# EAGLE design PowerMeterCurrent (EAGLE 9.3.0)
DATABASE: ../../../../digikeydb.txt
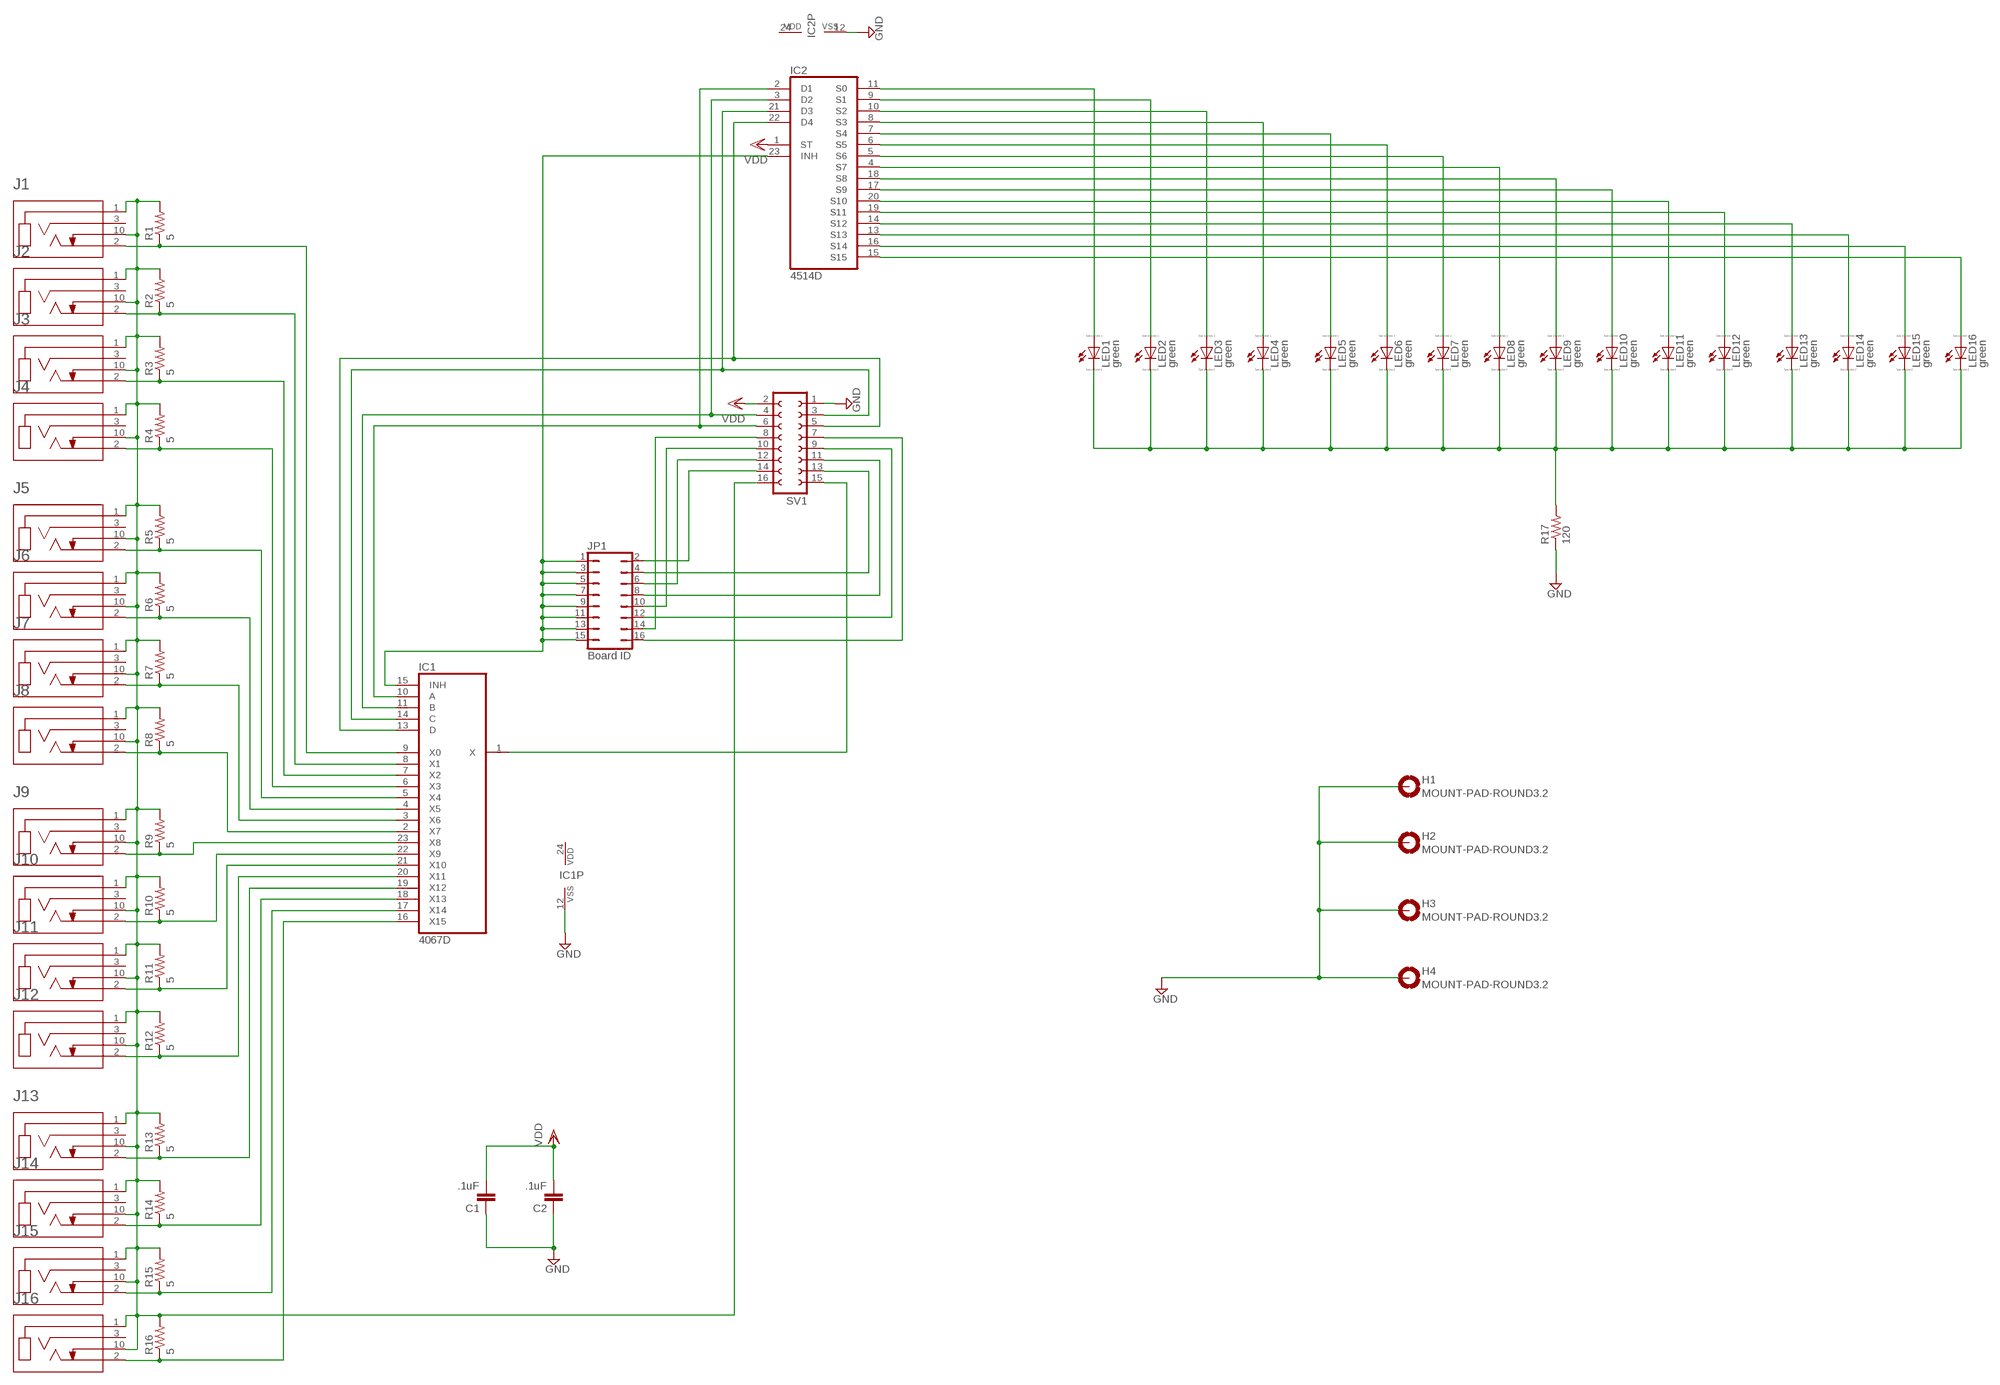
[diagram p0: schematic, sheet 1]

## Parts
C1  .1uF  C-EUC1206  [C1206]
C2  .1uF  C-EUC1206  [C1206]
H1  MOUNT-PAD-ROUND3.2  [3,2-PAD]
H2  MOUNT-PAD-ROUND3.2  [3,2-PAD]
H3  MOUNT-PAD-ROUND3.2  [3,2-PAD]
H4  MOUNT-PAD-ROUND3.2  [3,2-PAD]
IC1  4067D  [SO24W]
IC2  4514D  [SO24W]
J1  SJ2-35813B-SMT-TR  [CUI_SJ2-35813B-SMT-TR]
J2  SJ2-35813B-SMT-TR  [CUI_SJ2-35813B-SMT-TR]
J3  SJ2-35813B-SMT-TR  [CUI_SJ2-35813B-SMT-TR]
J4  SJ2-35813B-SMT-TR  [CUI_SJ2-35813B-SMT-TR]
J5  SJ2-35813B-SMT-TR  [CUI_SJ2-35813B-SMT-TR]
J6  SJ2-35813B-SMT-TR  [CUI_SJ2-35813B-SMT-TR]
J7  SJ2-35813B-SMT-TR  [CUI_SJ2-35813B-SMT-TR]
J8  SJ2-35813B-SMT-TR  [CUI_SJ2-35813B-SMT-TR]
J9  SJ2-35813B-SMT-TR  [CUI_SJ2-35813B-SMT-TR]
J10  SJ2-35813B-SMT-TR  [CUI_SJ2-35813B-SMT-TR]
J11  SJ2-35813B-SMT-TR  [CUI_SJ2-35813B-SMT-TR]
J12  SJ2-35813B-SMT-TR  [CUI_SJ2-35813B-SMT-TR]
J13  SJ2-35813B-SMT-TR  [CUI_SJ2-35813B-SMT-TR]
J14  SJ2-35813B-SMT-TR  [CUI_SJ2-35813B-SMT-TR]
J15  SJ2-35813B-SMT-TR  [CUI_SJ2-35813B-SMT-TR]
J16  SJ2-35813B-SMT-TR  [CUI_SJ2-35813B-SMT-TR]
JP1  Board ID  JP8Q  [JP8Q]
LED1  green  LED_E  [LED_1206]
LED2  green  LED_E  [LED_1206]
LED3  green  LED_E  [LED_1206]
LED4  green  LED_E  [LED_1206]
LED5  green  LED_E  [LED_1206]
LED6  green  LED_E  [LED_1206]
LED7  green  LED_E  [LED_1206]
LED8  green  LED_E  [LED_1206]
LED9  green  LED_E  [LED_1206]
LED10  green  LED_E  [LED_1206]
LED11  green  LED_E  [LED_1206]
LED12  green  LED_E  [LED_1206]
LED13  green  LED_E  [LED_1206]
LED14  green  LED_E  [LED_1206]
LED15  green  LED_E  [LED_1206]
LED16  green  LED_E  [LED_1206]
R1  5  R-US_R1206  [R1206]
R2  5  R-US_R1206  [R1206]
R3  5  R-US_R1206  [R1206]
R4  5  R-US_R1206  [R1206]
R5  5  R-US_R1206  [R1206]
R6  5  R-US_R1206  [R1206]
R7  5  R-US_R1206  [R1206]
R8  5  R-US_R1206  [R1206]
R9  5  R-US_R1206  [R1206]
R10  5  R-US_R1206  [R1206]
R11  5  R-US_R1206  [R1206]
R12  5  R-US_R1206  [R1206]
R13  5  R-US_R1206  [R1206]
R14  5  R-US_R1206  [R1206]
R15  5  R-US_R1206  [R1206]
R16  5  R-US_R1206  [R1206]
R17  120  R-US_R1206  [R1206]
SV1  FE08-2  [FE08-2]

## Nets
CT-: J1.1(SLEEVE) J1.10(TIP_SWITCH) J2.1(SLEEVE) J2.10(TIP_SWITCH) J3.1(SLEEVE) J3.10(TIP_SWITCH) J4.1(SLEEVE) J4.10(TIP_SWITCH) J5.1(SLEEVE) J5.10(TIP_SWITCH) J6.1(SLEEVE) J6.10(TIP_SWITCH) J7.1(SLEEVE) J7.10(TIP_SWITCH) J8.1(SLEEVE) J8.10(TIP_SWITCH) J9.1(SLEEVE) J9.10(TIP_SWITCH) J10.1(SLEEVE) J10.10(TIP_SWITCH) J11.1(SLEEVE) J11.10(TIP_SWITCH) J12.1(SLEEVE) J12.10(TIP_SWITCH) J13.1(SLEEVE) J13.10(TIP_SWITCH) J14.1(SLEEVE) J14.10(TIP_SWITCH) J15.1(SLEEVE) J15.10(TIP_SWITCH) J16.1(SLEEVE) J16.10(TIP_SWITCH) R1.2 R2.2 R3.2 R4.2 R5.2 R6.2 R7.2 R8.2 R9.2 R10.2 R11.2 R12.2 R13.2 R14.2 R15.2 R16.2 SV1.16
GND: C1.1 C2.1 H1.B3,2(MOUNT) H2.B3,2(MOUNT) H3.B3,2(MOUNT) H4.B3,2(MOUNT) IC1.12(VSS) IC2.12(VSS) R17.1 SV1.1
N$1: IC1.10(A) IC2.2(D1) SV1.6
N$2: IC2.15(S15) LED16.A
N$3: IC1.11(B) IC2.3(D2) SV1.4
N$4: IC1.14(C) IC2.21(D3) SV1.3
N$5: IC1.13(D) IC2.22(D4) SV1.5
N$6: IC1.15(INH) IC2.23(INH) JP1.1 JP1.3 JP1.5 JP1.7 JP1.9 JP1.11 JP1.13 JP1.15
N$7: JP1.14 SV1.8
N$8: JP1.10 SV1.10
N$9: IC2.16(S14) LED15.A
N$10: JP1.6 SV1.12
N$11: JP1.2 SV1.14
N$13: JP1.4 SV1.13
N$14: JP1.8 SV1.11
N$15: JP1.12 SV1.9
N$16: JP1.16 SV1.7
N$17: IC1.1(X) SV1.15
N$18: IC1.5(X4) J5.2(TIP) R5.1
N$19: IC2.13(S13) LED14.A
N$20: IC1.9(X0) J1.2(TIP) R1.1
N$21: LED1.C LED2.C LED3.C LED4.C LED5.C LED6.C LED7.C LED8.C LED9.C LED10.C LED11.C LED12.C LED13.C LED14.C LED15.C LED16.C R17.2
N$22: IC1.8(X1) J2.2(TIP) R2.1
N$23: IC1.7(X2) J3.2(TIP) R3.1
N$24: IC1.6(X3) J4.2(TIP) R4.1
N$25: IC1.4(X5) J6.2(TIP) R6.1
N$26: IC1.3(X6) J7.2(TIP) R7.1
N$28: IC1.2(X7) J8.2(TIP) R8.1
N$29: IC1.23(X8) J9.2(TIP) R9.1
N$30: IC2.14(S12) LED13.A
N$32: IC2.19(S11) LED12.A
N$34: IC2.20(S10) LED11.A
N$36: IC2.17(S9) LED10.A
N$38: IC2.18(S8) LED9.A
N$40: IC2.4(S7) LED8.A
N$42: IC2.5(S6) LED7.A
N$44: IC2.6(S5) LED6.A
N$46: IC2.7(S4) LED5.A
N$48: IC2.8(S3) LED4.A
N$50: IC1.22(X9) J10.2(TIP) R10.1
N$51: IC1.21(X10) J11.2(TIP) R11.1
N$52: IC2.10(S2) LED3.A
N$54: IC2.9(S1) LED2.A
N$56: IC2.11(S0) LED1.A
N$58: IC1.20(X11) J12.2(TIP) R12.1
N$59: IC1.18(X13) J14.2(TIP) R14.1
N$60: IC1.17(X14) J15.2(TIP) R15.1
N$66: IC1.19(X12) J13.2(TIP) R13.1
N$68: IC1.16(X15) J16.2(TIP) R16.1
VDD: C1.2 C2.2 IC2.1(ST) SV1.2
Unconnected: J1.3(RING) J2.3(RING) J3.3(RING) J4.3(RING) J5.3(RING) J6.3(RING) J7.3(RING) J8.3(RING) J9.3(RING) J10.3(RING) J11.3(RING) J12.3(RING) J13.3(RING) J14.3(RING) J15.3(RING) J16.3(RING)

## Power pins joined to a net without a drawn wire
VDD: IC1.24(VDD) IC2.24(VDD)

## Library data of the parts
C1 C2 = rcl:C-EU: CAPACITOR, European symbol; PARTNO: C1206C104K5RAC7867
H1-H4 = holes:MOUNT-PAD-ROUND: MOUNTING PAD, round
IC1 = 40xx:4067: 16-channel ANALOG MULTIPLEXER; PARTNO: 74HC4067D,652
IC2 = 45xx:4514: 4-bit latch 4-16 line DECODER; PARTNO: 74HC4514D,652
J1-J16 = SJ2-35813B-SMT-TR:SJ2-35813B-SMT-TR: 3 conductors, 3.5mm, SMT Audio Jack w/ Tip Switch; MANUFACTURER: CUI; MPN: SJ2-35813B-SMT-TR; PART_REV: 1.01; STANDARD: Manufacturer recommendation
JP1 = jumper:JP8Q: JUMPER; PARTNO: 67996-416HLF
LED1-LED16 = eagle-ltspice:LED_E: LED Source: http://www.osram.convergy.de Source: www.luxeon.com Source: www.kingbright.com; PARTNO: LTST-C150GKT; SPICEMODEL: NONE; SPICEPREFIX: D; SPICETYPE: diode
R1-R16 = resistor:R-US_: RESISTOR, American symbol; PARTNO: RC1206FR-075R1L
R17 = resistor:R-US_: RESISTOR, American symbol; PARTNO: RC1206FR-07120RL
SV1 = con-lsta:FE08-2: FEMALE HEADER; OC_FARNELL: unknown; OC_NEWARK: unknown; PARTNO: SSQ-108-02-T-D

## Board
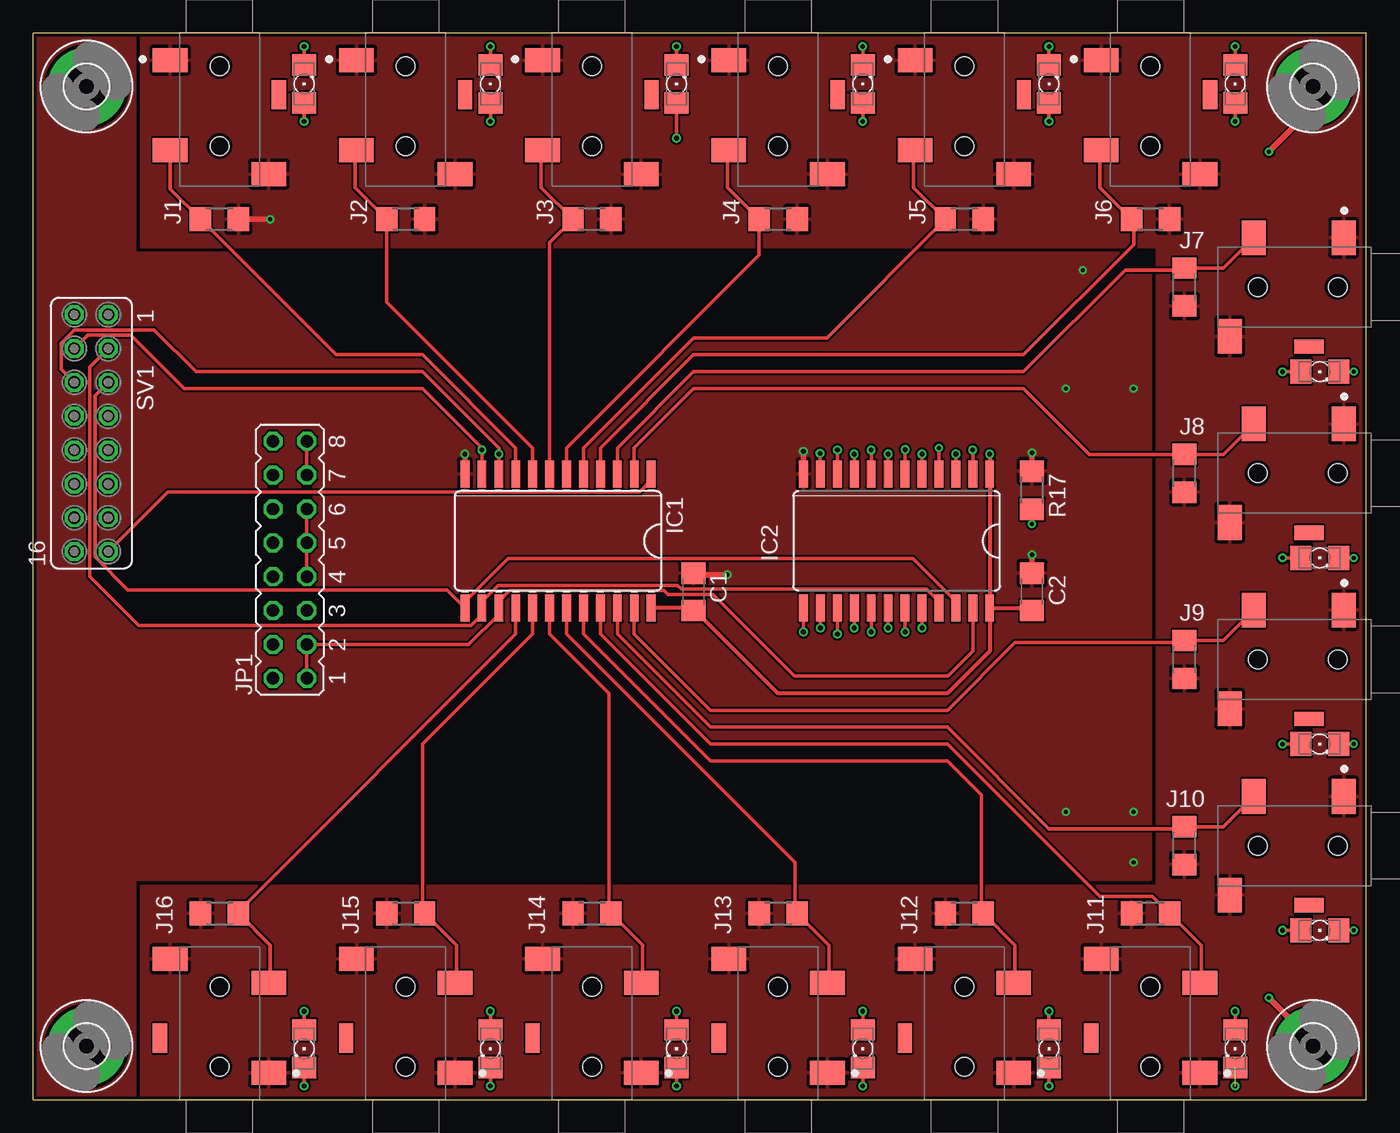
[diagram p1: board, top side]
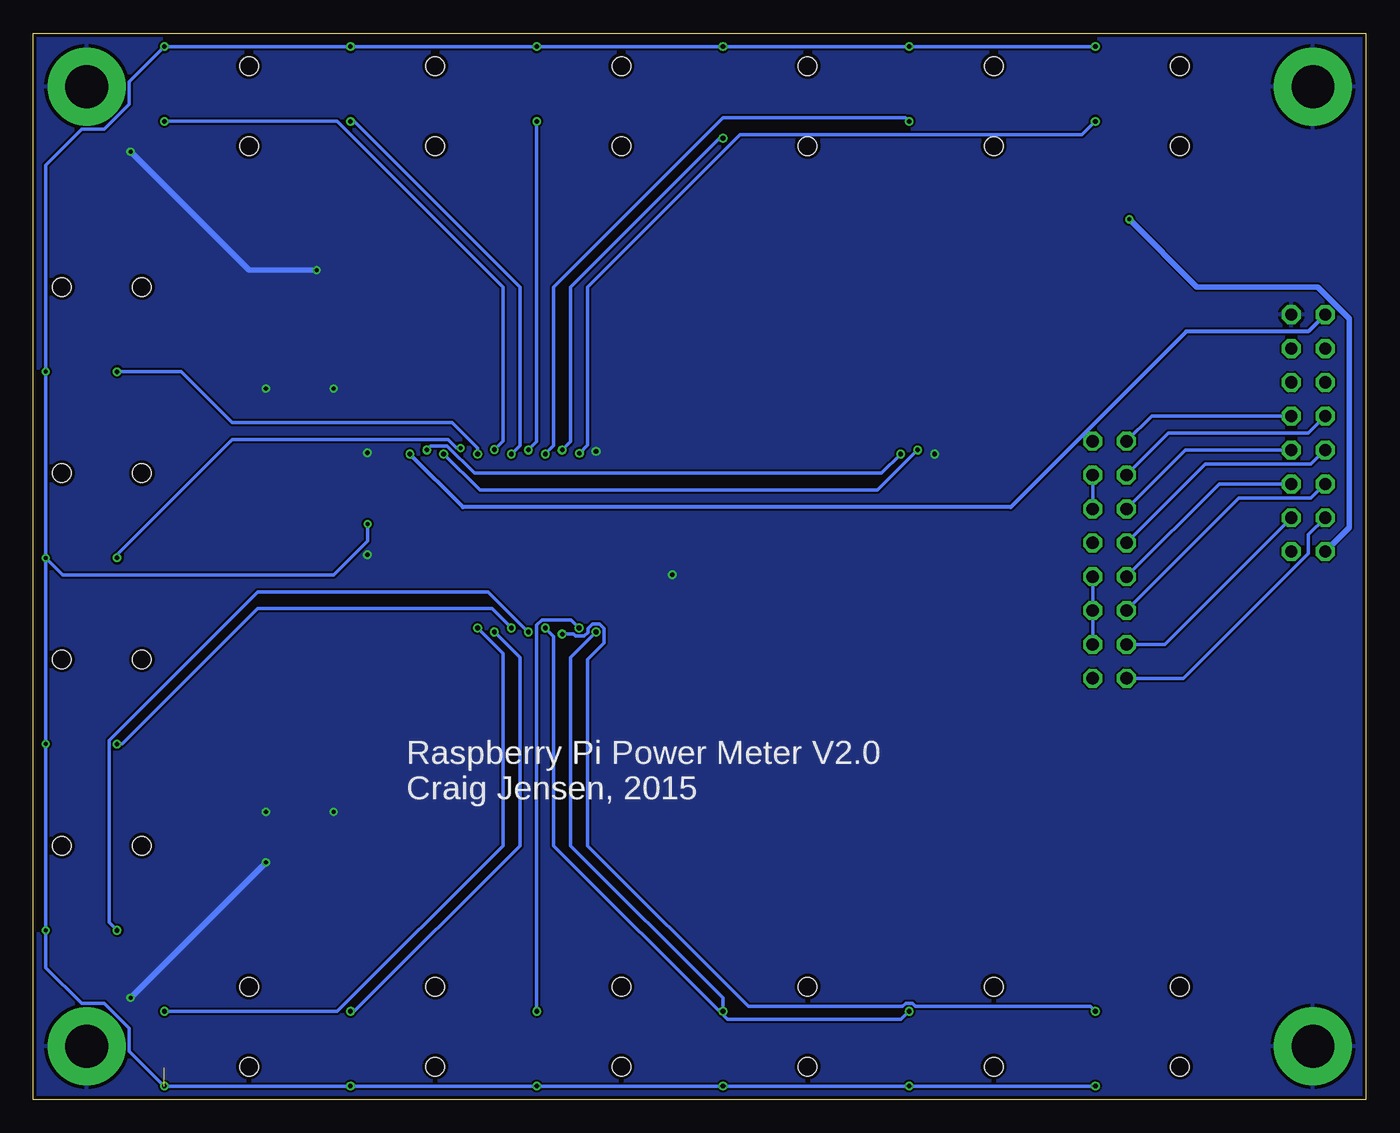
[diagram p2: board, bottom side, seen from below]

Size 100 x 80 mm. Coordinates in mm from the lower left corner, seen from the top.
Outline: 0,0 100,0 100,80 0,80 0,0
Copper layers (1*16): Top 0.035mm / dielectric 1.5mm / Bottom 0.035mm
Design rules "Elecrow_2-layer_eagle_rule": minimum track width 6mil, minimum drill 12mil, track to track 6mil, track to pad 6mil, pad to pad 6mil, via to via 6mil, smd to smd 0mil, copper to edge 10mil, drill to drill 10mil, minimum pad ring 10mil, minimum via ring 6mil, stop-mask expansion 2mil, vias tented up to drill 100mil, thermal gap 10mil

### Footprints (pad centres in the part's own frame; a part is rotated, then mirrored left to right if it is on the bottom)
C1206 = smd 1.6 x 1.8: 1 -1.4,0; 2 1.4,0
3,2-PAD = drill 3.2 pad 5.842: B3,2 0,0
SO24W = smd 0.66 x 2.032: 1 -6.985,-5.029; 2 -5.715,-5.029; 3 -4.445,-5.029; 4 -3.175,-5.029; 5 -1.905,-5.029; 6 -0.635,-5.029; 7 0.635,-5.029; 8 1.905,-5.029; 9 3.175,-5.029; 10 4.445,-5.029; 11 5.715,-5.029; 12 6.985,-5.029; 13 6.985,5.029; 14 5.715,5.029; 15 4.445,5.029; 16 3.175,5.029; 17 1.905,5.029; 18 0.635,5.029; 19 -0.635,5.029; 20 -1.905,5.029; 21 -3.175,5.029; 22 -4.445,5.029; 23 -5.715,5.029; 24 -6.985,5.029
CUI_SJ2-35813B-SMT-TR = smd 1.8 x 2.6: 1 -3.7,-3.7; 2 3.05,-3.7; 10 4.85,3.7 | smd 2.184 x 1.067: 3 -1.1,4.462 | hole 1.4: -3.25,0; 2.75,0
JP8Q = drill 0.914 octagon: 1 -8.89,-1.27; 2 -8.89,1.27; 3 -6.35,-1.27; 4 -6.35,1.27; 5 -3.81,-1.27; 6 -3.81,1.27; 7 -1.27,-1.27; 8 -1.27,1.27; 9 1.27,-1.27; 10 1.27,1.27; 11 3.81,-1.27; 12 3.81,1.27; 13 6.35,-1.27; 14 6.35,1.27; 15 8.89,-1.27; 16 8.89,1.27
LED_1206 = smd 1.6 x 1.803: A -1.422,0; C 1.422,0
R1206 = smd 1.6 x 1.803: 1 -1.422,0; 2 1.422,0
FE08-2 = drill 0.914 octagon: 1 -8.89,1.27; 2 -8.89,-1.27; 3 -6.35,1.27; 4 -6.35,-1.27; 5 -3.81,1.27; 6 -3.81,-1.27; 7 -1.27,1.27; 8 -1.27,-1.27; 9 1.27,1.27; 10 1.27,-1.27; 11 3.81,1.27; 12 3.81,-1.27; 13 6.35,1.27; 14 6.35,-1.27; 15 8.89,1.27; 16 8.89,-1.27

### Placement (x,y rotation side)
C1  49.53,38.1 270 top
C2  74.93,38.1 270 top
H1  4,76 0 top
H2  96,76 0 top
H3  96,4 0 top
H4  4,4 0 top
IC1  39.37,41.91 180 top
IC2  64.77,41.91 180 top
J1  13.97,74.3 270 top
J2  27.94,74.3 270 top
J3  41.91,74.3 270 top
J4  55.88,74.3 270 top
J5  69.85,74.3 270 top
J6  83.82,74.3 270 top
J7  94.61,60.96 180 top
J8  94.61,46.99 180 top
J9  94.61,33.02 180 top
J10  94.61,19.05 180 top
J11  83.82,5.71 90 top
J12  69.85,5.71 90 top
J13  55.88,5.71 90 top
J14  41.91,5.71 90 top
J15  27.94,5.71 90 top
J16  13.97,5.71 90 top
JP1  19.25,40.5 90 top
LED1  20.32,76.2 90 top
LED2  34.29,76.2 90 top
LED3  48.26,76.2 90 top
LED4  62.23,76.2 90 top
LED5  76.2,76.2 90 top
LED6  90.17,76.2 90 top
LED7  96.52,54.61 0 top
LED8  96.52,40.64 0 top
LED9  96.52,26.67 0 top
LED10  96.52,12.7 0 top
LED11  90.17,3.81 270 top
LED12  76.2,3.81 270 top
LED13  62.23,3.81 270 top
LED14  48.26,3.81 270 top
LED15  34.29,3.81 270 top
LED16  20.32,3.81 270 top
R1  13.97,66.04 0 top
R2  27.94,66.04 0 top
R3  41.91,66.04 0 top
R4  55.88,66.04 0 top
R5  69.85,66.04 0 top
R6  83.82,66.04 0 top
R7  86.36,60.96 270 top
R8  86.36,46.99 270 top
R9  86.36,33.02 270 top
R10  86.36,19.05 270 top
R11  83.82,13.97 180 top
R12  69.85,13.97 180 top
R13  55.88,13.97 180 top
R14  41.91,13.97 180 top
R15  27.94,13.97 180 top
R16  13.97,13.97 180 top
R17  74.93,45.72 270 top
SV1  4.35,50 270 top

### Tracks (layer width: path | path; a pad name or v marks a point on that pad's centre or on a via)
CT-  (via drill 0.3)
  Top 0.406: R1.2 v17.78,66.04
  Bottom 0.406: v17.78,66.04 12.7,60.96 3.64,60.96 1.27,58.59 1.27,42.92 SV1.16
  pour Top: 8.13,16 84.33,16 84.33,64.01 8.13,64.01 8.13,81.28 102.87,81.28 102.87,-1.27 8.13,-1.27
GND  (via drill 0.3, 0.35)
  Top 0.406: C2.1 v74.93,40.88 | R17.1 v74.93,48.52 | IC2.12 v57.78,48.64 | C1.1 49.66,39.37 v52.07,39.37 | IC1.12 v32.38,48.44 | H3.B3,2 96,4.25 96.27,3.99 96.27,4.06 v92.71,7.62 | H2.B3,2 96,74.41 v92.71,71.12
  Bottom 0.406: v92.71,7.62 v82.55,17.78 | v92.71,71.12 83.82,62.23 v78.74,62.23
  other vias: 82.55,21.59 77.47,21.59 77.47,53.34 82.55,53.34
  pour Bottom: 102,81.28 102,-3.25 -1.25,-3 -1.25,81
  pour Top: -1.27,81.28 7.62,81.28 7.62,63.5 83.82,63.5 83.82,16.51 7.62,16.51 7.62,-1.27 -2.54,-1.27 -2.54,81.28
N$1  (via drill 0.35)
  Top 0.254: IC1.10 v34.92,48.44 34.92,48.9 29.21,54.61 12.21,54.61 9.07,57.75 3.08,57.75 2.09,56.76 2.09,54.8 SV1.6 | IC2.2 v70.48,48.74
  Bottom 0.254: v70.48,48.74 70.18,49.04 68.96,49.04 66.91,46.99 36.37,46.99 v34.92,48.44
N$2  (via drill 0.35)
  Top 0.254: LED16.A v20.32,6.61 | IC2.15 v60.33,34.92
  Bottom 0.254: v60.33,34.92 59.45,34.92 59.31,34.78 58.66,34.78 58.39,35.05 58.39,35.33 58.04,35.69 57.53,35.69 57.18,35.33 57.18,34.26 58.42,33.02 58.42,19.05 46.35,6.99 34.78,6.99 34.54,7.22 34.04,7.22 33.8,6.99 20.69,6.99 v20.32,6.61
N$3  (via drill 0.35)
  Top 0.254: IC1.11 v33.66,48.74 33.66,48.9 29.21,53.34 11.3,53.34 7.3,57.34 4.07,57.34 SV1.4 | IC2.3 v69.22,48.44
  Bottom 0.254: v69.22,48.44 66.5,45.72 36.67,45.72 v33.66,48.74
N$4
  Top 0.254: IC2.21 67.94,37.35 67,38.3 48.63,38.3 48.35,38.58 34.88,38.58 33.66,37.35 IC1.14 33.66,36.41 32.83,35.59 7.9,35.59 4.22,39.26 4.22,54.95 SV1.3
N$5
  Top 0.254: IC2.22 69.22,37.35 65.99,40.58 35.61,40.58 32.38,37.35 IC1.13 31.03,38.24 7.09,38.24 4.63,40.7 4.63,52.82 SV1.5
N$6
  Top 0.254: IC2.23 70.48,33.66 68.61,31.77 57.12,31.77 51.01,37.89 47.6,37.89 47.32,38.18 35.75,38.18 34.92,37.35 IC1.15 34.92,36.41 32.67,34.15 JP1.3 JP1.1 | JP1.7 JP1.9 JP1.11 | JP1.15 JP1.13
  Bottom 0.254: JP1.7 JP1.5 JP1.3 | JP1.11 JP1.13
N$7
  Bottom 0.254: JP1.14 14.83,50 4.35,50 SV1.8
N$8
  Bottom 0.254: JP1.10 12.08,47.67 4.14,47.67 SV1.10
N$9  (via drill 0.35)
  Top 0.254: IC2.16 v61.59,35.38 | LED15.A v34.29,6.61
  Bottom 0.254: v61.59,35.38 60.96,34.75 60.96,19.05 47.92,6.01 34.9,6.01 v34.29,6.61
N$10
  Bottom 0.254: JP1.6 9.54,45.13 4.14,45.13 SV1.12
N$11
  Bottom 0.254: JP1.2 13.72,31.61 4.35,40.98 4.35,42.38 SV1.14
N$13
  Bottom 0.254: JP1.4 15.12,34.15 SV1.13
N$14
  Bottom 0.254: JP1.8 11.02,46.19 SV1.11
N$15
  Bottom 0.254: JP1.12 13.56,48.73 SV1.9
N$16
  Bottom 0.254: JP1.16 16.1,51.27 SV1.7
N$17
  Top 0.254: 46.35,46.47 IC1.1 46.35,46.47 | 46.35,46.47 45.47,45.58 10.09,45.58 SV1.15
N$18
  Top 0.254: 68.66,66.27 R5.1 | 41.27,47.62 IC1.5 41.27,48.9 49.53,57.15 59.54,57.15 R5.1 | R5.1 66.04,68.43 66.04,71.14 J5.2
N$19  (via drill 0.35)
  Top 0.254: IC2.13 v57.78,35.08 | LED14.A v48.26,6.61
  Bottom 0.254: v57.78,35.08 59.69,33.18 59.69,19.05 48.26,7.62 v48.26,6.61
N$20
  Top 0.254: IC1.9 36.2,48.9 29.21,55.88 22.71,55.88 R1.1 10.27,68.32 J1.2
N$21  (via drill 0.3, 0.35)  (1 unrouted)
  Top 0.254: LED16.C v20.32,1.01 | LED15.C v34.29,1.01 | LED14.C v48.26,1.01 | LED13.C v62.23,1.01 | LED12.C v76.2,1.01 | LED6.C v90.17,79 | LED5.C v76.2,79 | LED4.C v62.23,79 | LED3.C v48.26,79 | LED2.C v34.29,79 | LED1.C v20.32,79 | LED7.C v99.06,54.61 | v99.06,40.64 LED8.C | LED9.C v99.06,26.67 | LED10.C v99.06,12.7 | v74.93,43.18 R17.2
  Bottom 0.254: v20.32,79 v34.29,79 v48.26,79 v62.23,79 v76.2,79 v90.17,79 92.8,76.37 92.8,74.67 94.67,72.8 96.37,72.8 99.06,70.11 v99.06,54.61 v99.06,40.64 | v20.32,1.01 v34.29,1.01 v48.26,1.01 v62.23,1.01 v76.2,1.01 v90.17,1.01 92.8,3.64 92.8,5.33 94.67,7.2 96.36,7.2 99.06,9.9 v99.06,12.7 v99.06,26.67 v99.06,40.64 | v99.06,40.64 97.79,39.37 77.47,39.37 74.93,41.91 v74.93,43.18
N$22
  Top 0.254: IC1.8 37.47,48.9 26.52,59.84 R2.1 24.13,68.43 24.13,71.14 J2.2
N$23
  Top 0.254: J3.2 38.1,71.14 38.1,68.43 R3.1 38.73,64.29 IC1.7
N$24
  Top 0.254: 54.69,66.27 R4.1 | IC1.6 40.01,48.9 54.46,63.35 R4.1 | R4.1 52.07,68.43 52.07,71.14 J4.2
N$25
  Top 0.254: 82.63,66.27 R6.1 | 42.55,47.62 IC1.4 42.55,48.9 49.53,55.88 74.3,55.88 82.55,64.14 82.55,65.89 R6.1 | R6.1 80.01,68.43 80.01,71.14 J6.2
N$26
  Top 0.254: IC1.3 43.81,48.9 49.53,54.61 74.3,54.61 81.92,62.23 86.21,62.23 R7.1 89.29,62.38 J7.2
N$28
  Top 0.254: R8.1 79.22,48.41 74.3,53.34 49.53,53.34 45.09,48.9 IC1.2 | R8.1 86.59,48.18 | J8.2 89.29,48.41 R8.1
N$29
  Top 0.254: IC1.23 45.09,34.92 50.8,29.21 68.58,29.21 73.66,34.29 86.21,34.29 R9.1 89.29,34.44 J9.2
N$30  (via drill 0.35)
  Top 0.254: IC2.14 v59.05,35.38 | LED13.A v62.23,6.61
  Bottom 0.254: v59.05,35.38 59.66,35.99 61.85,35.99 62.23,35.61 v62.23,6.61
N$32  (via drill 0.35)
  Top 0.254: IC2.19 v65.41,35.08 | LED12.A v76.2,6.61
  Bottom 0.254: v65.41,35.08 63.5,33.18 63.5,19.05 75.94,6.61 v76.2,6.61
N$34  (via drill 0.35)
  Top 0.254: IC2.20 v66.67,35.38 | LED11.A v90.17,6.61
  Bottom 0.254: v66.67,35.38 64.77,33.48 64.77,19.05 77.21,6.61 v90.17,6.61
N$36  (via drill 0.35)
  Top 0.254: IC2.17 v62.87,35.08 | LED10.A v93.72,12.7
  Bottom 0.254: v93.72,12.7 94.32,13.31 94.32,26.96 83.19,38.1 65.88,38.1 v62.87,35.08
N$38  (via drill 0.35)
  Top 0.254: IC2.18 v64.14,35.38 | LED9.A v93.72,26.67
  Bottom 0.254: v93.72,26.67 93.34,26.67 83.19,36.83 65.58,36.83 v64.14,35.38
N$40  (via drill 0.3, 0.35)
  Top 0.254: LED8.A v93.72,40.64 | IC2.4 v67.94,48.9
  Bottom 0.254: v67.94,48.9 68.24,48.9 68.88,49.53 85.09,49.53 93.72,40.9 v93.72,40.64
N$42  (via drill 0.35)
  Top 0.254: IC2.5 v66.67,48.44 | LED7.A v93.72,54.61
  Bottom 0.254: v93.72,54.61 88.9,54.61 85.09,50.8 68.58,50.8 66.67,48.9 v66.67,48.44
N$44  (via drill 0.35)
  Top 0.254: 65.41,46.47 IC2.6 v65.41,48.77 | LED6.A v90.17,73.4
  Bottom 0.254: 65.41,48.9 v65.41,48.77 64.77,49.4 64.77,60.96 77.21,73.4 v90.17,73.4
N$46  (via drill 0.35)
  Top 0.254: IC2.7 v64.14,48.44 | LED5.A v76.2,73.4
  Bottom 0.254: v76.2,73.4 75.94,73.4 63.5,60.96 63.5,49.07 v64.14,48.44
N$48  (via drill 0.35)
  Top 0.254: IC2.8 v62.87,48.74 | LED4.A v62.23,73.4
  Bottom 0.254: v62.23,73.4 62.23,49.37 v62.87,48.74
N$50
  Top 0.254: IC1.22 43.81,34.92 50.8,27.94 68.58,27.94 76.2,20.32 86.21,20.32 R10.1 89.29,20.47 J10.2
N$51
  Top 0.254: IC1.21 42.55,34.92 50.8,26.67 68.58,26.67 80.01,15.24 83.97,15.24 R11.1 87.63,11.58 87.63,8.88 J11.2
N$52  (via drill 0.35)
  Top 0.254: IC2.10 v60.33,48.74 | LED3.A v48.26,72.13
  Bottom 0.254: v48.26,72.13 48.52,72.13 59.69,60.96 59.69,49.37 v60.33,48.74
N$54  (via drill 0.35)
  Top 0.254: IC2.9 v61.59,48.44 | LED2.A v34.29,73.4
  Bottom 0.254: v34.29,73.4 34.55,73.66 48.26,73.66 60.96,60.96 60.96,49.07 v61.59,48.44
N$56  (via drill 0.35)
  Top 0.254: LED1.A v20.32,73.4 | v59.02,48.49 59.02,46.97 IC2.11
  Bottom 0.254: v20.32,73.4 21.33,72.39 46.99,72.39 58.42,60.96 58.42,49.09 v59.02,48.49
N$58
  Top 0.254: IC1.20 41.27,34.92 50.8,25.4 68.58,25.4 71.12,22.86 71.12,14.12 R12.1 73.66,11.58 73.66,8.88 J12.2
N$59
  Top 0.254: IC1.18 38.73,34.92 43.18,30.48 43.18,14.12 R14.1 45.75,11.55 45.72,11.53 45.72,8.88 J14.2
N$60
  Top 0.254: IC1.17 37.47,34.92 29.21,26.67 29.21,14.12 R15.1 31.75,11.58 31.75,8.88 J15.2
N$66
  Top 0.254: IC1.19 40.01,34.92 57.15,17.78 57.15,14.12 R13.1 59.69,11.58 59.69,8.88 J13.2
N$68
  Top 0.254: IC1.16 36.2,34.92 15.39,14.12 R16.1 17.78,11.58 17.78,8.88 J16.2
VDD  (via drill 0.35)
  Top 0.254: C1.2 49.35,36.88 | IC2.1 v71.75,48.44 | 74.75,36.88 C2.2
  Top 0.305: 49.35,36.88 IC1.24 | IC2.24 71.75,33.66 68.58,30.48 55.88,30.48 49.66,36.7 C1.2 | IC2.24 74.75,36.88 | v71.75,48.44 IC2.24
  Bottom 0.305: SV1.2 4.35,57.62 13.5,57.62 26.67,44.45 67.77,44.45 v71.75,48.44

### Text on the board
bPlace: Raspberry Pi Power Meter V2.0 / Craig Jensen, 2015